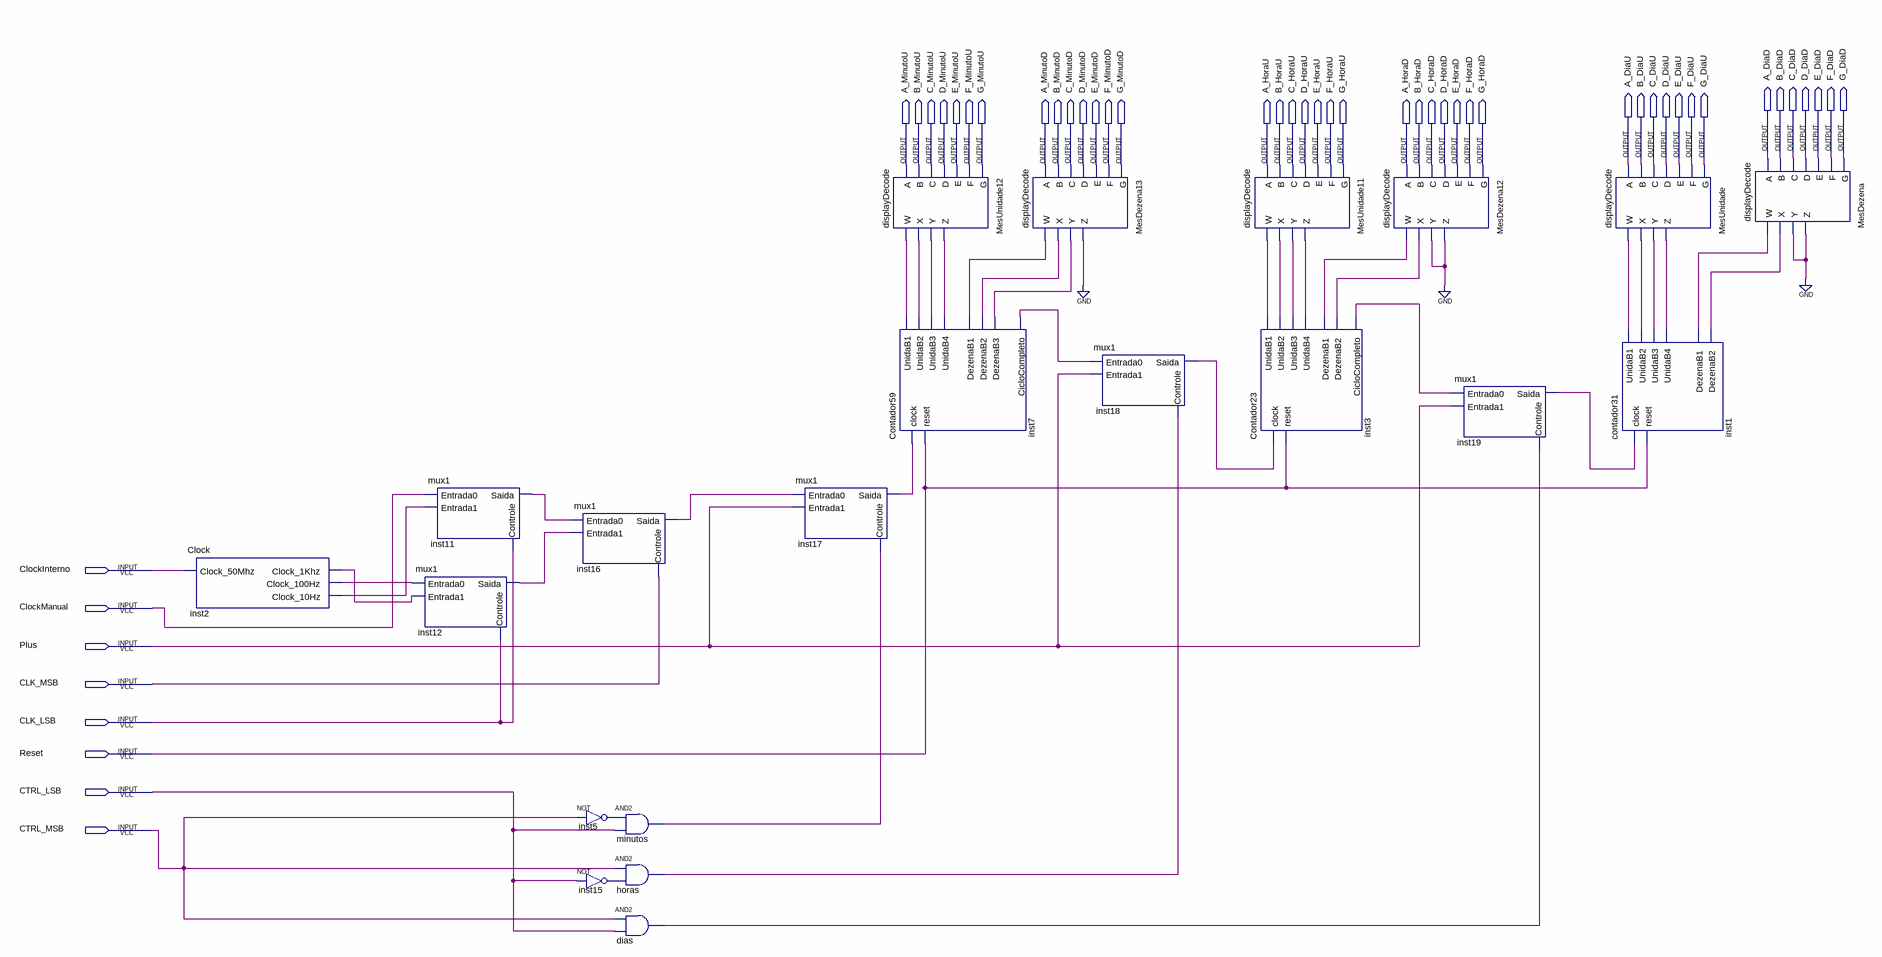
[diagram p0: schematic sheet]
// Quartus schematic Calendario.bdf as structural Verilog: 21 symbols, 50 pins
module Calendario (
  input  ClockInterno,
  input  ClockManual,
  input  Plus,
  input  CLK_MSB,
  input  CLK_LSB,
  input  Reset,
  input  CTRL_LSB,
  input  CTRL_MSB,
  output A_DiaD,
  output B_DiaD,
  output C_DiaD,
  output D_DiaD,
  output E_DiaD,
  output F_DiaD,
  output G_DiaD,
  output A_DiaU,
  output B_DiaU,
  output C_DiaU,
  output D_DiaU,
  output E_DiaU,
  output F_DiaU,
  output G_DiaU,
  output A_MinutoU,
  output B_MinutoU,
  output C_MinutoU,
  output D_MinutoU,
  output E_MinutoU,
  output F_MinutoU,
  output G_MinutoU,
  output A_MinutoD,
  output B_MinutoD,
  output C_MinutoD,
  output D_MinutoD,
  output E_MinutoD,
  output F_MinutoD,
  output G_MinutoD,
  output A_HoraU,
  output B_HoraU,
  output C_HoraU,
  output D_HoraU,
  output E_HoraU,
  output F_HoraU,
  output G_HoraU,
  output A_HoraD,
  output B_HoraD,
  output C_HoraD,
  output D_HoraD,
  output E_HoraD,
  output F_HoraD,
  output G_HoraD
);

  wire dias_out, horas_out, inst1_dezenab1, inst1_dezenab2, inst1_unidab1, inst1_unidab2, inst1_unidab3,
       inst1_unidab4, inst2_clock_1khz, inst2_clock_10hz, inst2_clock_100hz, inst3_ciclocompleto,
       inst3_dezenab1, inst3_dezenab2, inst3_unidab1, inst3_unidab2, inst3_unidab3, inst3_unidab4, inst5_out,
       inst7_ciclocompleto, inst7_dezenab1, inst7_dezenab2, inst7_dezenab3, inst7_unidab1, inst7_unidab2,
       inst7_unidab3, inst7_unidab4, inst11_saida, inst12_saida, inst15_out, inst16_saida, inst17_saida,
       inst18_saida, inst19_saida, minutos_out;

  Clock inst2 (
    .Clock_50Mhz(ClockInterno), .Clock_1Khz(inst2_clock_1khz), .Clock_100Hz(inst2_clock_100hz),
    .Clock_10Hz(inst2_clock_10hz));
  mux1 inst12 (.Controle(CLK_LSB), .Entrada1(inst2_clock_1khz), .Entrada0(inst2_clock_100hz), .Saida(inst12_saida));
  mux1 inst11 (.Controle(CLK_LSB), .Entrada1(inst2_clock_10hz), .Entrada0(ClockManual), .Saida(inst11_saida));
  mux1 inst16 (.Controle(CLK_MSB), .Entrada1(inst12_saida), .Entrada0(inst11_saida), .Saida(inst16_saida));
  and minutos (minutos_out, inst5_out, CTRL_LSB);
  not inst5 (inst5_out, CTRL_MSB);
  and horas (horas_out, CTRL_MSB, inst15_out);
  not inst15 (inst15_out, CTRL_LSB);
  and dias (dias_out, CTRL_MSB, CTRL_LSB);
  mux1 inst17 (.Controle(minutos_out), .Entrada1(Plus), .Entrada0(inst16_saida), .Saida(inst17_saida));
  displayDecode MesUnidade12 (
    .Y(inst7_unidab3), .W(inst7_unidab1), .X(inst7_unidab2), .Z(inst7_unidab4), .A(A_MinutoU), .B(B_MinutoU),
    .C(C_MinutoU), .D(D_MinutoU), .E(E_MinutoU), .F(F_MinutoU), .G(G_MinutoU));
  Contador59 inst7 (
    .clock(inst17_saida), .reset(Reset), .DezenaB2(inst7_dezenab2), .UnidaB2(inst7_unidab2),
    .UnidaB3(inst7_unidab3), .UnidaB4(inst7_unidab4), .DezenaB1(inst7_dezenab1), .UnidaB1(inst7_unidab1),
    .DezenaB3(inst7_dezenab3), .CicloCompleto(inst7_ciclocompleto));
  displayDecode MesDezena13 (
    .Y(inst7_dezenab3), .W(inst7_dezenab1), .X(inst7_dezenab2), .Z(1'b0), .A(A_MinutoD), .B(B_MinutoD),
    .C(C_MinutoD), .D(D_MinutoD), .E(E_MinutoD), .F(F_MinutoD), .G(G_MinutoD));
  mux1 inst18 (.Controle(horas_out), .Entrada1(Plus), .Entrada0(inst7_ciclocompleto), .Saida(inst18_saida));
  displayDecode MesUnidade11 (
    .Y(inst3_unidab3), .W(inst3_unidab1), .X(inst3_unidab2), .Z(inst3_unidab4), .A(A_HoraU), .B(B_HoraU),
    .C(C_HoraU), .D(D_HoraU), .E(E_HoraU), .F(F_HoraU), .G(G_HoraU));
  Contador23 inst3 (
    .clock(inst18_saida), .reset(Reset), .DezenaB2(inst3_dezenab2), .UnidaB2(inst3_unidab2),
    .UnidaB3(inst3_unidab3), .UnidaB4(inst3_unidab4), .DezenaB1(inst3_dezenab1), .UnidaB1(inst3_unidab1),
    .CicloCompleto(inst3_ciclocompleto));
  displayDecode MesDezena12 (
    .Y(1'b0), .W(inst3_dezenab1), .X(inst3_dezenab2), .Z(1'b0), .A(A_HoraD), .B(B_HoraD), .C(C_HoraD),
    .D(D_HoraD), .E(E_HoraD), .F(F_HoraD), .G(G_HoraD));
  mux1 inst19 (.Controle(dias_out), .Entrada1(Plus), .Entrada0(inst3_ciclocompleto), .Saida(inst19_saida));
  displayDecode MesUnidade (
    .Y(inst1_unidab3), .W(inst1_unidab1), .X(inst1_unidab2), .Z(inst1_unidab4), .A(A_DiaU), .B(B_DiaU),
    .C(C_DiaU), .D(D_DiaU), .E(E_DiaU), .F(F_DiaU), .G(G_DiaU));
  contador31 inst1 (
    .clock(inst19_saida), .reset(Reset), .DezenaB2(inst1_dezenab2), .UnidaB2(inst1_unidab2),
    .UnidaB3(inst1_unidab3), .UnidaB4(inst1_unidab4), .DezenaB1(inst1_dezenab1), .UnidaB1(inst1_unidab1));
  displayDecode MesDezena (
    .Y(1'b0), .W(inst1_dezenab1), .X(inst1_dezenab2), .Z(1'b0), .A(A_DiaD), .B(B_DiaD), .C(C_DiaD),
    .D(D_DiaD), .E(E_DiaD), .F(F_DiaD), .G(G_DiaD));
endmodule
